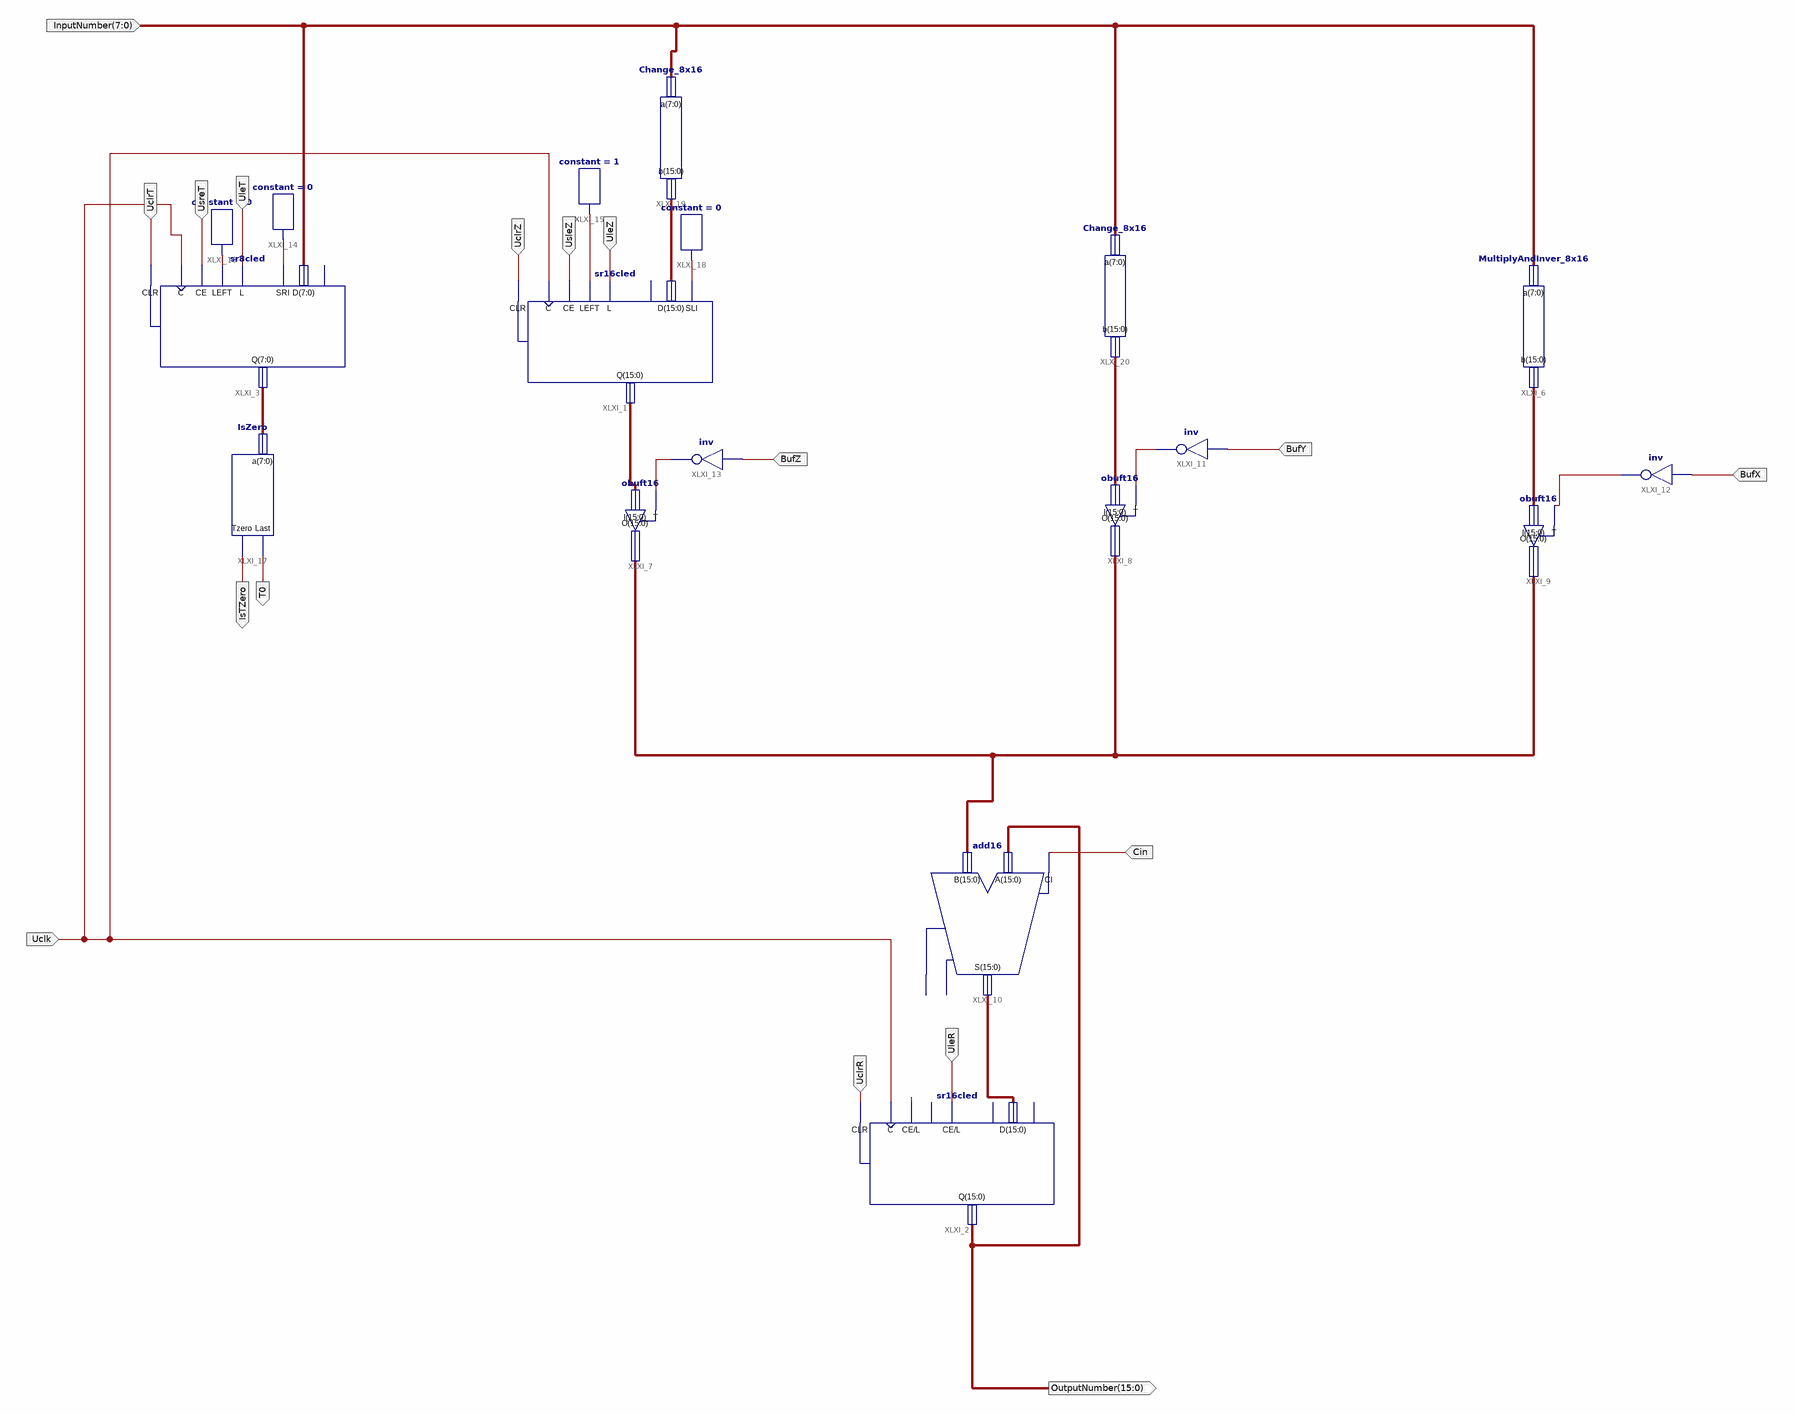
[diagram p0: schematic sheet 1]
// Xilinx ISE schematic OperationalUnit.sch (spartan3a) as structural Verilog: 18 symbols, 17 ports
module OperationalUnit (
  input  [7:0] InputNumber,
  input  UsreT,
  input  UclrT,
  input  UleT,
  input  UsleZ,
  input  UclrZ,
  input  UleZ,
  input  BufX,
  input  BufY,
  input  Cin,
  input  UclrR,
  input  UleR,
  input  Uclk,
  input  BufZ,
  output [15:0] OutputNumber,
  output IsTZero,
  output T0
);

  wire XLXN_60, XLXN_62, XLXN_63, XLXN_77, XLXN_78, XLXN_79, XLXN_85;
  wire [7:0] XLXN_80;
  wire [15:0] XLXN_21, XLXN_22, XLXN_23, XLXN_25, XLXN_26, XLXN_28;

  sr16cled XLXI_1 (
    .C(Uclk), .CE(UsleZ), .CLR(UclrZ), .D(XLXN_21), .L(UleZ), .LEFT(XLXN_77), .SLI(XLXN_85), .Q(XLXN_22));  // open: SRI
  sr16cled XLXI_2 (.C(Uclk), .CE(UleR), .CLR(UclrR), .D(XLXN_28), .L(UleR), .Q(OutputNumber));  // open: LEFT, SLI, SRI
  sr8cled XLXI_3 (
    .C(Uclk), .CE(UsreT), .CLR(UclrT), .D(InputNumber), .L(UleT), .LEFT(XLXN_79), .SRI(XLXN_78), .Q(XLXN_80));  // open: SLI
  MultiplyAndInver_8x16 XLXI_6 (.a(InputNumber), .b(XLXN_25));
  obuft16 XLXI_7 (.I(XLXN_22), .T(XLXN_62), .O(XLXN_26));
  obuft16 XLXI_8 (.I(XLXN_23), .T(XLXN_60), .O(XLXN_26));
  obuft16 XLXI_9 (.I(XLXN_25), .T(XLXN_63), .O(XLXN_26));
  add16 XLXI_10 (.A(OutputNumber), .B(XLXN_26), .CI(Cin), .S(XLXN_28));  // open: CO, OFL
  not XLXI_11 (XLXN_60, BufY);
  not XLXI_12 (XLXN_63, BufX);
  constant #(.CValue("0")) XLXI_14 (.O(XLXN_78));
  constant #(.CValue("1")) XLXI_15 (.O(XLXN_77));
  constant #(.CValue("0")) XLXI_16 (.O(XLXN_79));
  IsZero XLXI_17 (.a(XLXN_80), .Last(T0), .Tzero(IsTZero));
  constant #(.CValue("0")) XLXI_18 (.O(XLXN_85));
  Change_8x16 XLXI_19 (.a(InputNumber), .b(XLXN_21));
  Change_8x16 XLXI_20 (.a(InputNumber), .b(XLXN_23));
  not XLXI_13 (XLXN_62, BufZ);
endmodule
